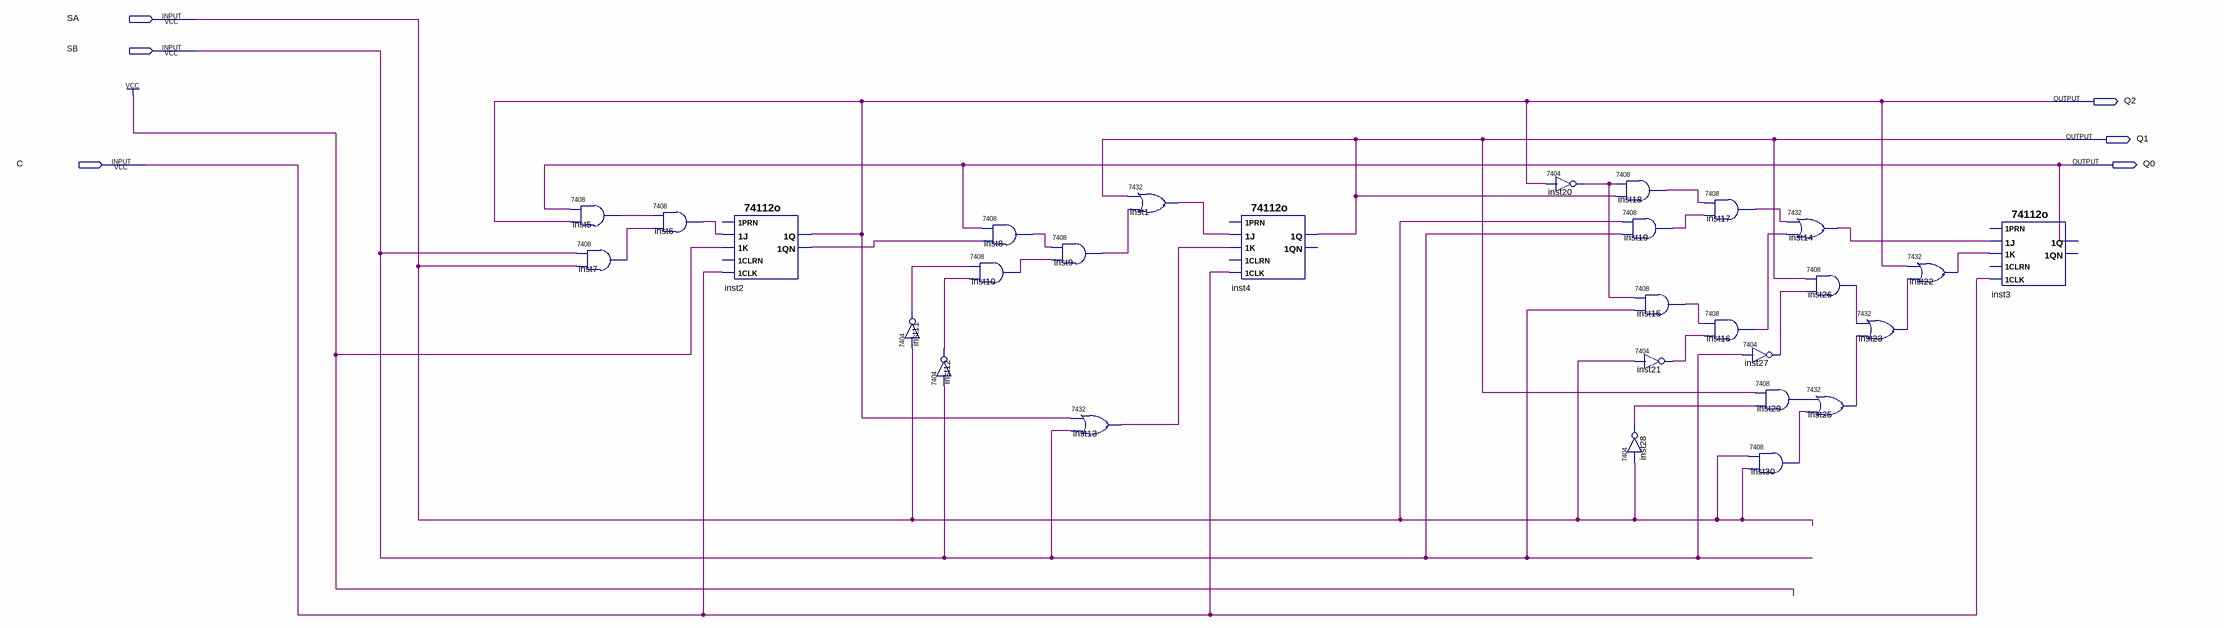
[diagram p0: schematic sheet]
// Quartus schematic estado_estacionamento.bdf as structural Verilog: 29 symbols, 6 pins
module estado_estacionamento (
  input  SA,
  input  SB,
  input  C,
  output Q2,
  output Q1,
  output Q0
);

  wire inst1_1, inst2_1qn, inst5_1, inst6_1, inst7_1, inst8_1, inst9_1, inst10_1, inst11_1, inst12_1,
       inst13_1, inst14_1, inst15_1, inst16_1, inst17_1, inst18_1, inst19_1, inst20_1, inst21_1, inst22_1,
       inst23_1, inst25_1, inst26_1, inst27_1, inst28_1, inst29_1, inst30_1;

  \7408  inst5 (.\3 (Q2), .\2 (Q0), .\1 (inst5_1));
  \7408  inst7 (.\3 (SA), .\2 (SB), .\1 (inst7_1));
  \7408  inst6 (.\3 (inst7_1), .\2 (inst5_1), .\1 (inst6_1));
  \74112o  inst2 (.\1CLK (C), .\1J (inst6_1), .\1K (1'b1), .\1QN (inst2_1qn), .\1Q (Q2));  // open: 1PRN, 1CLRN
  \7404  inst11 (.\2 (SA), .\1 (inst11_1));
  \7408  inst10 (.\3 (inst12_1), .\2 (inst11_1), .\1 (inst10_1));
  \7404  inst12 (.\2 (SB), .\1 (inst12_1));
  \7408  inst8 (.\3 (inst2_1qn), .\2 (Q0), .\1 (inst8_1));
  \7408  inst9 (.\3 (inst10_1), .\2 (inst8_1), .\1 (inst9_1));
  \7432  inst13 (.\2 (Q2), .\3 (SB), .\1 (inst13_1));
  \7432  inst1 (.\2 (Q1), .\3 (inst9_1), .\1 (inst1_1));
  \74112o  inst4 (.\1CLK (C), .\1J (inst1_1), .\1K (inst13_1), .\1Q (Q1));  // open: 1PRN, 1CLRN, 1QN
  \7404  inst20 (.\2 (Q2), .\1 (inst20_1));
  \7408  inst18 (.\3 (Q1), .\2 (inst20_1), .\1 (inst18_1));
  \7408  inst19 (.\3 (SB), .\2 (SA), .\1 (inst19_1));
  \7404  inst28 (.\2 (SA), .\1 (inst28_1));
  \7408  inst15 (.\3 (SB), .\2 (inst20_1), .\1 (inst15_1));
  \7404  inst21 (.\2 (SA), .\1 (inst21_1));
  \7408  inst17 (.\3 (inst19_1), .\2 (inst18_1), .\1 (inst17_1));
  \7408  inst16 (.\3 (inst21_1), .\2 (inst15_1), .\1 (inst16_1));
  \7404  inst27 (.\2 (SB), .\1 (inst27_1));
  \7408  inst29 (.\3 (inst28_1), .\2 (Q1), .\1 (inst29_1));
  \7408  inst30 (.\3 (SA), .\2 (SA), .\1 (inst30_1));
  \7432  inst14 (.\2 (inst17_1), .\3 (inst16_1), .\1 (inst14_1));
  \7408  inst26 (.\3 (inst27_1), .\2 (Q1), .\1 (inst26_1));
  \7432  inst25 (.\2 (inst29_1), .\3 (inst30_1), .\1 (inst25_1));
  \7432  inst23 (.\2 (inst26_1), .\3 (inst25_1), .\1 (inst23_1));
  \7432  inst22 (.\2 (Q2), .\3 (inst23_1), .\1 (inst22_1));
  \74112o  inst3 (.\1CLK (C), .\1J (inst14_1), .\1K (inst22_1), .\1Q (Q0));  // open: 1PRN, 1CLRN, 1QN
endmodule
